# Altium schematic sheet Schematic.SchDoc
size A4
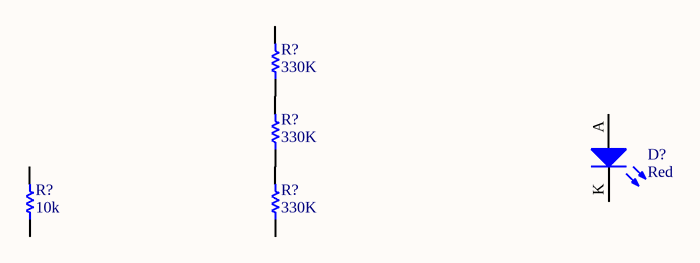
[diagram p0: Schematic.SchDoc]

## Parts
(Parts that share a designator on the sheet are numbered #1, #2 ... from top to bottom, then left to right.)
D?  Red  [0805 LED]
R?#1  330K  [VB 0207]
R?#2  330K  [VB 0207]
R?#3  10k  [0805]
R?#4  330K  [VB 0207]

## Nets
NetR?#1_1: R?#1.1 R?#2.2
NetR?#2_1: R?#2.1 R?#4.2

Not connected (* = marked no-connect by the designer): D? A K; R?#1 2; R?#3 1 2; R?#4 1

## Library data of the parts
D? = SML-210LTT86: Red LED Indication - Discrete 1.75V 0805 (2012 Metric); Manufacturer: ROHM Semiconductor; Part Number: SML-210LTT86; Colour: Red; Digikey Part Number: 511-1286-1-ND; Digikey Link: https://www.digikey.com/product-detail/en/rohm-semiconductor/SML-210LTT86/511-1286-1-ND/637099
R?#1 R?#2 R?#4 = MMB02070C3303FB200: Manufacturer: Vishay Beyschlag; Tolerance: 0.01; Rated Voltage: 1W; Part Number: MMB02070C3303FB200; Value: 330K; Digikey Part Number: MMB-330KBCT-ND
R?#3 = RC0805FR0710KL: Manufacturer: YAGEO; Tolerance: 0.01; Rated Voltage: 0.125W; Part Number: RC0805FR0710KL; Value: 10k; Material: FR-07